# EAGLE design Rev4 (EAGLE 4.16)
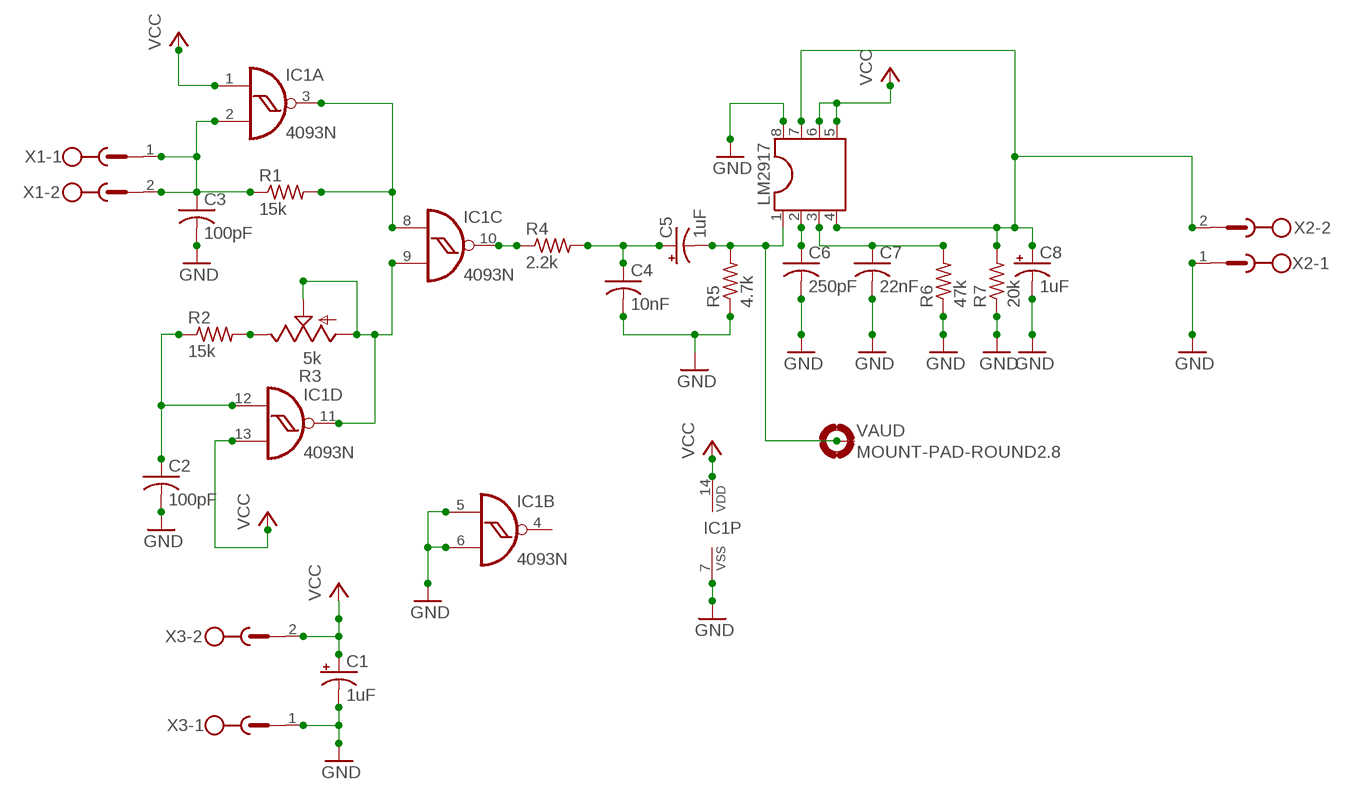
[diagram p0: schematic, sheet 1]

## Parts
C1  1uF  CPOL-USE2.5-5  [E2,5-5]
C2  100pF  C-US025-025X050  [C025-025X050]
C3  100pF  C-US025-025X050  [C025-025X050]
C4  10nF  C-US050-030X075  [C050-030X075]
C5  1uF  CPOL-USE2.5-5  [E2,5-5]
C6  250pF  C-US075-032X103  [C075-032X103]
C7  22nF  C-US025-025X050  [C025-025X050]
C8  1uF  CPOL-USE2.5-5  [E2,5-5]
IC1  4093N  [DIL14]
LM2917  DIL8  [DIL08]
R1  15k  R-US_0414/15  [0414/15]
R2  15k  R-US_0414/15  [0414/15]
R3  5k  TRIM_US-B25P  [B25P]
R4  2.2k  R-US_0414/15  [0414/15]
R5  4.7k  R-US_0414/15  [0414/15]
R6  47k  R-US_0414/15  [0414/15]
R7  20k  R-US_0414/15  [0414/15]
VAUD  MOUNT-PAD-ROUND2.8  [2,8-PAD]
X1  MSTBV2  [MSTBV2]
X2  MSTBV2  [MSTBV2]
X3  MSTBV2  [MSTBV2]

## Nets
GND: C1.- C2.2 C3.2 C4.2 C6.2 C7.2 C8.- IC1.5(B:I0) IC1.6(B:I1) IC1.7(P:VSS) LM2917.8 R5.1 R6.1 R7.1 X2.1 X3.1
N$1: R2.2 R3.E
N$2: IC1.3(A:O) IC1.8(C:I0) R1.2
N$3: C3.1 IC1.2(A:I1) R1.1 X1.1 X1.2
N$4: C2.1 IC1.12(D:I0) R2.1
N$5: C6.1 LM2917.2
N$6: C8.+ LM2917.4 LM2917.7 R7.2 X2.2
N$7: IC1.10(C:O) R4.1
N$10: C5.- LM2917.1 R5.2 VAUD.B2,8(MOUNT)
N$12: C7.1 LM2917.3 R6.2
N$14: C4.1 C5.+ R4.2
N$17: IC1.9(C:I1) IC1.11(D:O) R3.A R3.S
VCC: C1.+ IC1.1(A:I0) IC1.13(D:I1) IC1.14(P:VDD) LM2917.5 LM2917.6 X3.2
Unconnected: IC1.4(B:O)

## Library data of the parts
C1 C5 C8 = rcl:CPOL-US: POLARIZED CAPACITOR, American symbol
C2-C4 C6 C7 = rcl:C-US: CAPACITOR, American symbol
IC1 = 40xx:4093: Quad 2-input NAND schmitt trigger
LM2917 = ic-package:DIL8: Dual In Line
R1 R2 R4-R7 = rcl:R-US_: RESISTOR, American symbol
R3 = pot:TRIM_US-: POTENTIOMETER
VAUD = holes:MOUNT-PAD-ROUND: MOUNTING PAD, round
X1-X3 = con-phoenix-500:MSTBV2: PHOENIX

## Board
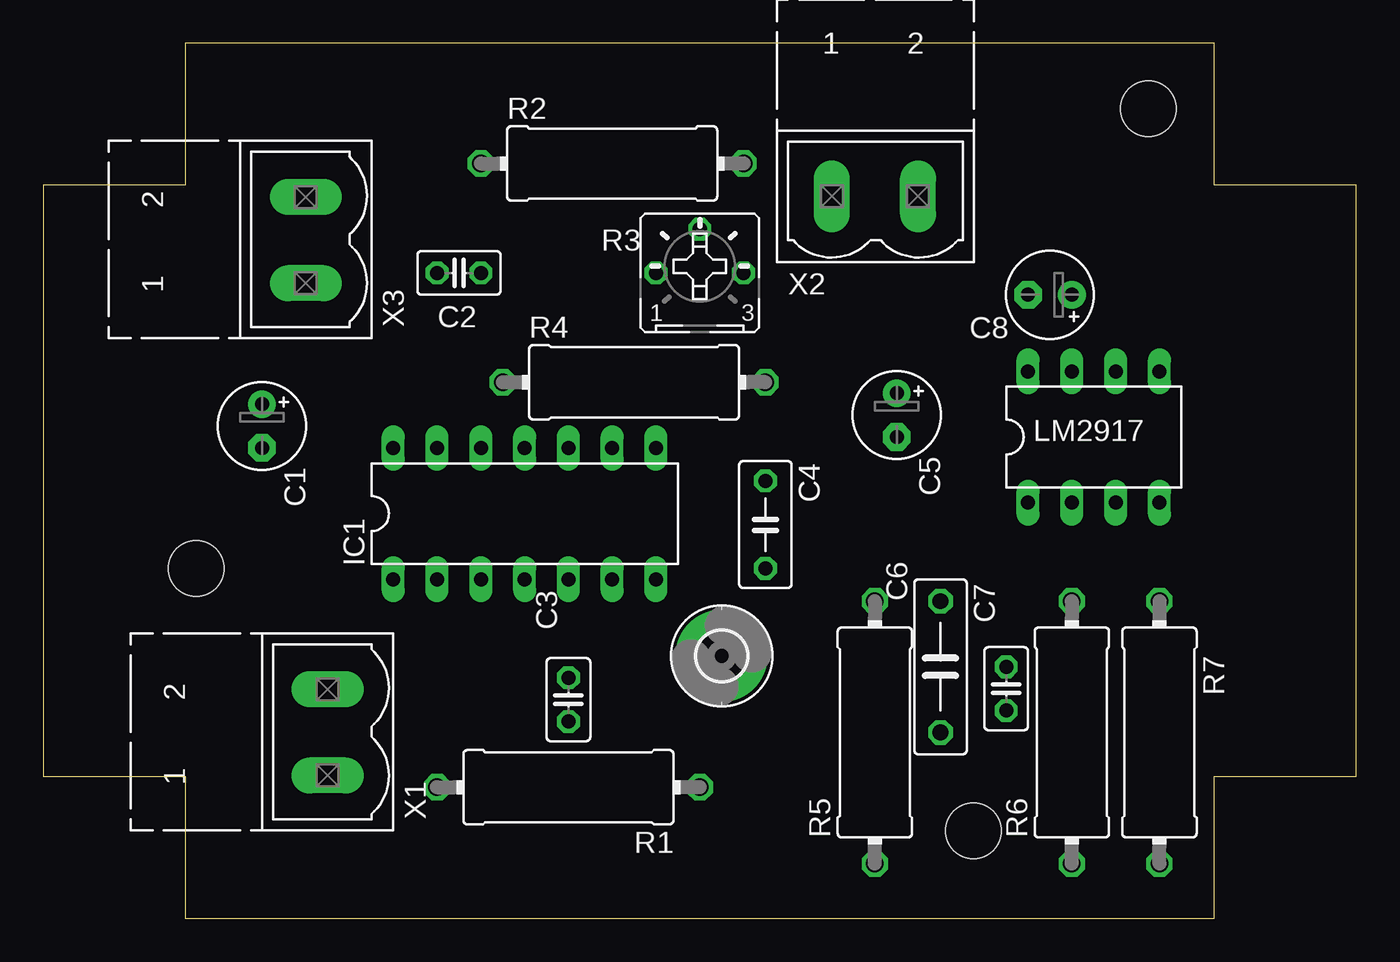
[diagram p1: board, top side]
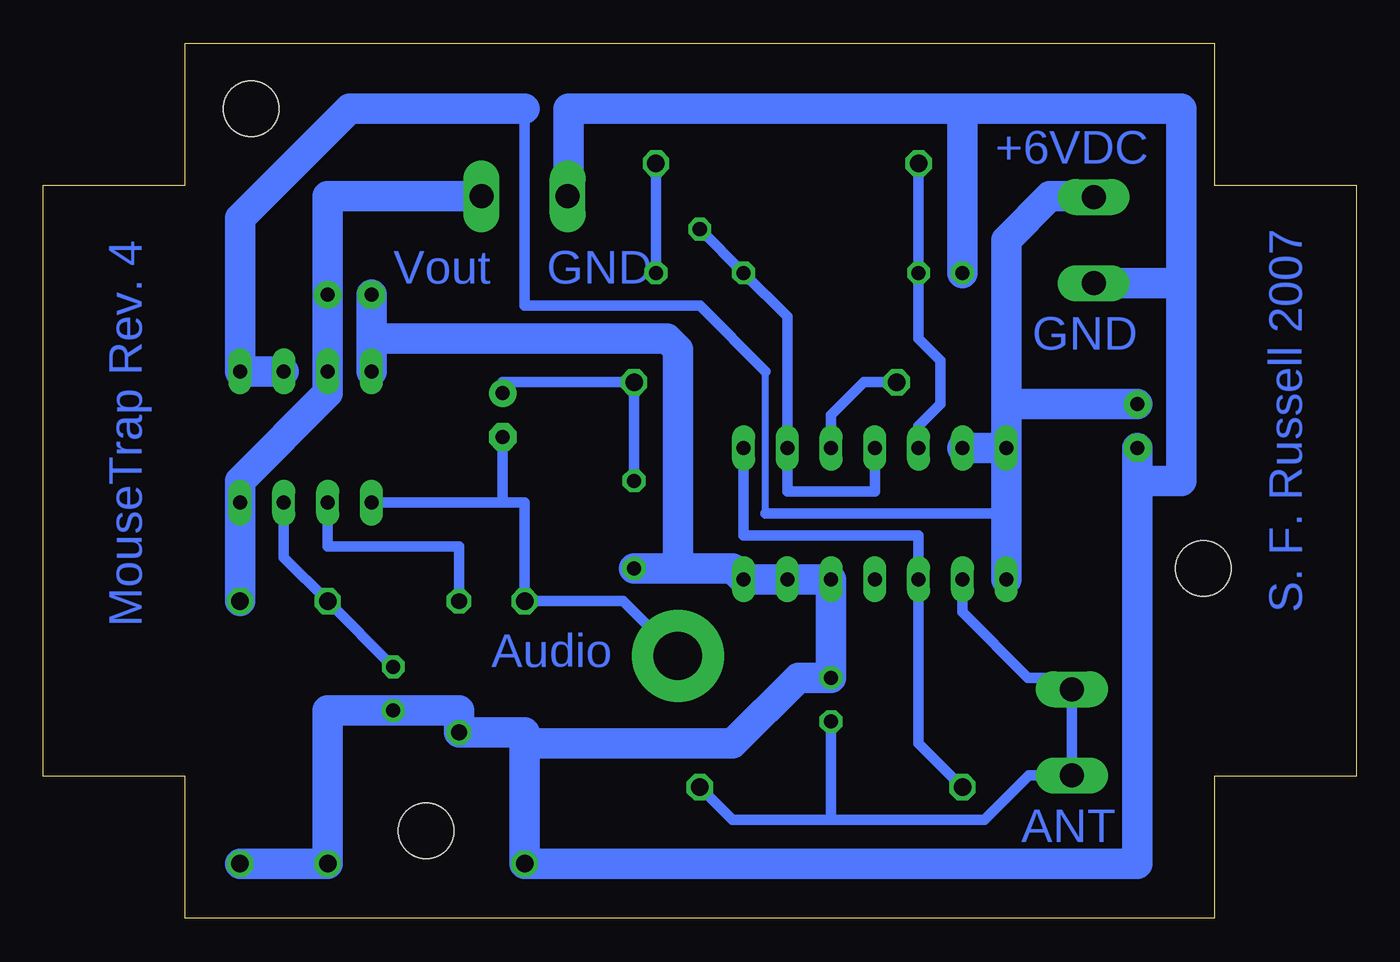
[diagram p2: board, bottom side, seen from below]

Size 76.2 x 50.8 mm. Coordinates in mm from the lower left corner, seen from the top.
Outline: 0,8.26 8.26,8.26 8.26,0 67.94,0 67.94,8.26 76.2,8.26 76.2,42.55 67.94,42.55 67.94,50.8 8.26,50.8 8.26,42.55 0,42.55 0,8.26
Copper layers (1*16): Top 0.035mm / dielectric 1.5mm / Bottom 0.035mm
Design rules "default": minimum track width 10mil, minimum drill 24mil, track to track 10mil, track to pad 10mil, pad to pad 10mil, via to via 10mil, smd to smd 8mil, copper to edge 40mil, drill to drill 8mil, minimum pad ring 10mil, minimum via ring 8mil, stop-mask expansion 4mil, vias tented up to drill 0mil, thermal gap 10mil
Holes 3.2 mm at 8.89,20.32 64.14,46.99 53.98,5.08

### Footprints (pad centres in the part's own frame; a part is rotated, then mirrored left to right if it is on the bottom)
E2,5-5 = drill 0.813 pad 1.6 round: + -1.27,0 | drill 0.813 pad 1.6 octagon: - 1.27,0
C025-025X050 = drill 0.813 octagon: 1 -1.27,0; 2 1.27,0
C050-030X075 = drill 0.813 octagon: 1 -2.54,0; 2 2.54,0
C075-032X103 = drill 0.914 octagon: 1 -3.81,0; 2 3.81,0
DIL14 = drill 0.813 long: 1 -7.62,-3.81; 2 -5.08,-3.81; 3 -2.54,-3.81; 4 0,-3.81; 5 2.54,-3.81; 6 5.08,-3.81; 7 7.62,-3.81; 8 7.62,3.81; 9 5.08,3.81; 10 2.54,3.81; 11 0,3.81; 12 -2.54,3.81; 13 -5.08,3.81; 14 -7.62,3.81
DIL08 = drill 0.813 long: 1 -3.81,-3.81; 2 -1.27,-3.81; 3 1.27,-3.81; 4 3.81,-3.81; 5 3.81,3.81; 6 1.27,3.81; 7 -1.27,3.81; 8 -3.81,3.81
0414/15 = drill 1.016 octagon: 1 -7.62,0; 2 7.62,0
B25P = drill 0.813 octagon: A -2.54,0; E 2.54,0; S 0,2.54
2,8-PAD = drill 2.8 pad 5.334 round: B2,8 0,0
MSTBV2 = drill 1.397 long: 1 -2.5,0; 2 2.5,0

### Placement (x,y rotation side)
C1  12.7,28.57 270 top
C2  24.13,37.47 180 top
C3  30.48,12.7 90 top
C4  41.91,22.86 270 top
C5  49.53,29.21 270 top
C6  52.07,14.61 270 top
C7  55.88,13.34 270 top
C8  58.42,36.2 180 top
IC1  27.94,23.5 0 top
LM2917  60.96,27.94 0 top
R1  30.48,7.62 180 top
R2  33.02,43.81 0 top
R3  38.1,37.47 0 top
R4  34.29,31.11 0 top
R5  48.26,10.79 90 top
R6  59.69,10.79 90 top
R7  64.77,10.79 90 top
VAUD  39.37,15.24 0 top
X1  16.51,10.79 90 top
X2  48.26,41.91 0 top
X3  15.24,39.37 90 top

### Tracks (layer width: path | path; a pad name or v marks a point on that pad's centre or on a via)
GND
  Bottom 0.61: 45.72,41.91 X2.1
  Bottom 1.778: 10.16,36.87 X3.1 | 10.16,36.87 10.16,46.99 22.86,46.99 | 22.86,46.99 45.72,46.99 45.72,41.91 | 12.7,25.4 12.7,3.17 R5.1 48.26,10.16 | 12.7,25.4 C1.- | 12.7,25.4 10.16,25.4 10.16,36.87 | R7.1 R6.1 59.69,12.06 C7.2 52.07,12.06 C6.2 48.26,10.79 48.26,10.16 | 39.37,20.32 36.2,20.32 IC1.7 IC1.6 IC1.5 C3.2 32.38,13.97 36.2,10.16 48.26,10.16 | 39.37,20.32 C4.2 | 57.15,33.66 40.01,33.66 39.37,33.02 39.37,20.32 | 57.15,33.66 LM2917.8 | 22.86,46.99 C2.2 | 57.15,33.66 C8.-
N$1
  Bottom 0.61: R3.E R2.2
N$2
  Bottom 0.61: IC1.8 35.56,22.23 25.4,22.23 IC1.3 25.4,10.16 R1.2
N$3
  Bottom 0.61: X1.1 16.51,8.89 | X1.1 X1.2 16.51,13.97 19.05,13.97 22.86,17.78 IC1.2 | X1.1 19.01,8.29 21.59,5.71 30.48,5.71 | 30.48,5.71 36.2,5.71 R1.1 | 30.48,5.71 C3.1
N$4
  Bottom 0.61: IC1.12 25.4,28.57 24.13,29.84 24.13,32.38 25.4,33.66 C2.1 R2.1
N$5
  Bottom 0.61: LM2917.2 59.69,21.59 52.07,21.59 C6.1
N$6
  Bottom 1.778: R7.2 LM2917.4 64.77,25.4 59.69,30.48 LM2917.7 C8.+ 59.69,41.91 X2.2
N$7
  Bottom 0.61: R4.1 28.57,31.11 30.48,29.21 IC1.10
N$10
  Bottom 0.61: 49.53,24.13 48.26,24.13 R5.2 42.55,18.41 VAUD.B2,8 | 49.53,24.13 LM2917.1 | 49.53,24.13 50.04,24.13 | 49.53,24.13 C5.-
N$12
  Bottom 0.61: LM2917.3 62.23,20.95 R6.2 C7.1
N$14
  Bottom 0.61: C4.1 R4.2 49.53,31.11 C5.+
N$17
  Bottom 0.61: R3.S R3.A 33.02,34.92 IC1.9 33.02,24.77 27.94,24.77 IC1.11
VCC
  Bottom 0.406: 34.29,23.5 34.29,31.75 | 20.32,29.21 20.19,29.08
  Bottom 0.61: 48.26,46.99 48.26,35.56 38.1,35.56 34.29,31.75 | 20.32,23.5 34.29,23.5
  Bottom 1.778: LM2917.6 LM2917.5 64.77,40.64 58.42,46.99 48.26,46.99 | IC1.1 20.32,23.5 IC1.14 | X3.2 15.28,41.91 17.78,41.91 20.32,39.37 20.32,29.84 | IC1.14 20.32,29.21 20.32,29.84 | IC1.14 IC1.13 | 20.32,29.84 C1.+

### Text on the board
Bottom: +6VDC | S. F. Russell 2007 | MouseTrap Rev. 4 | GND | Vout | GND | Audio | ANT